# EAGLE design stm32f3-shield (EAGLE 7.4.0)
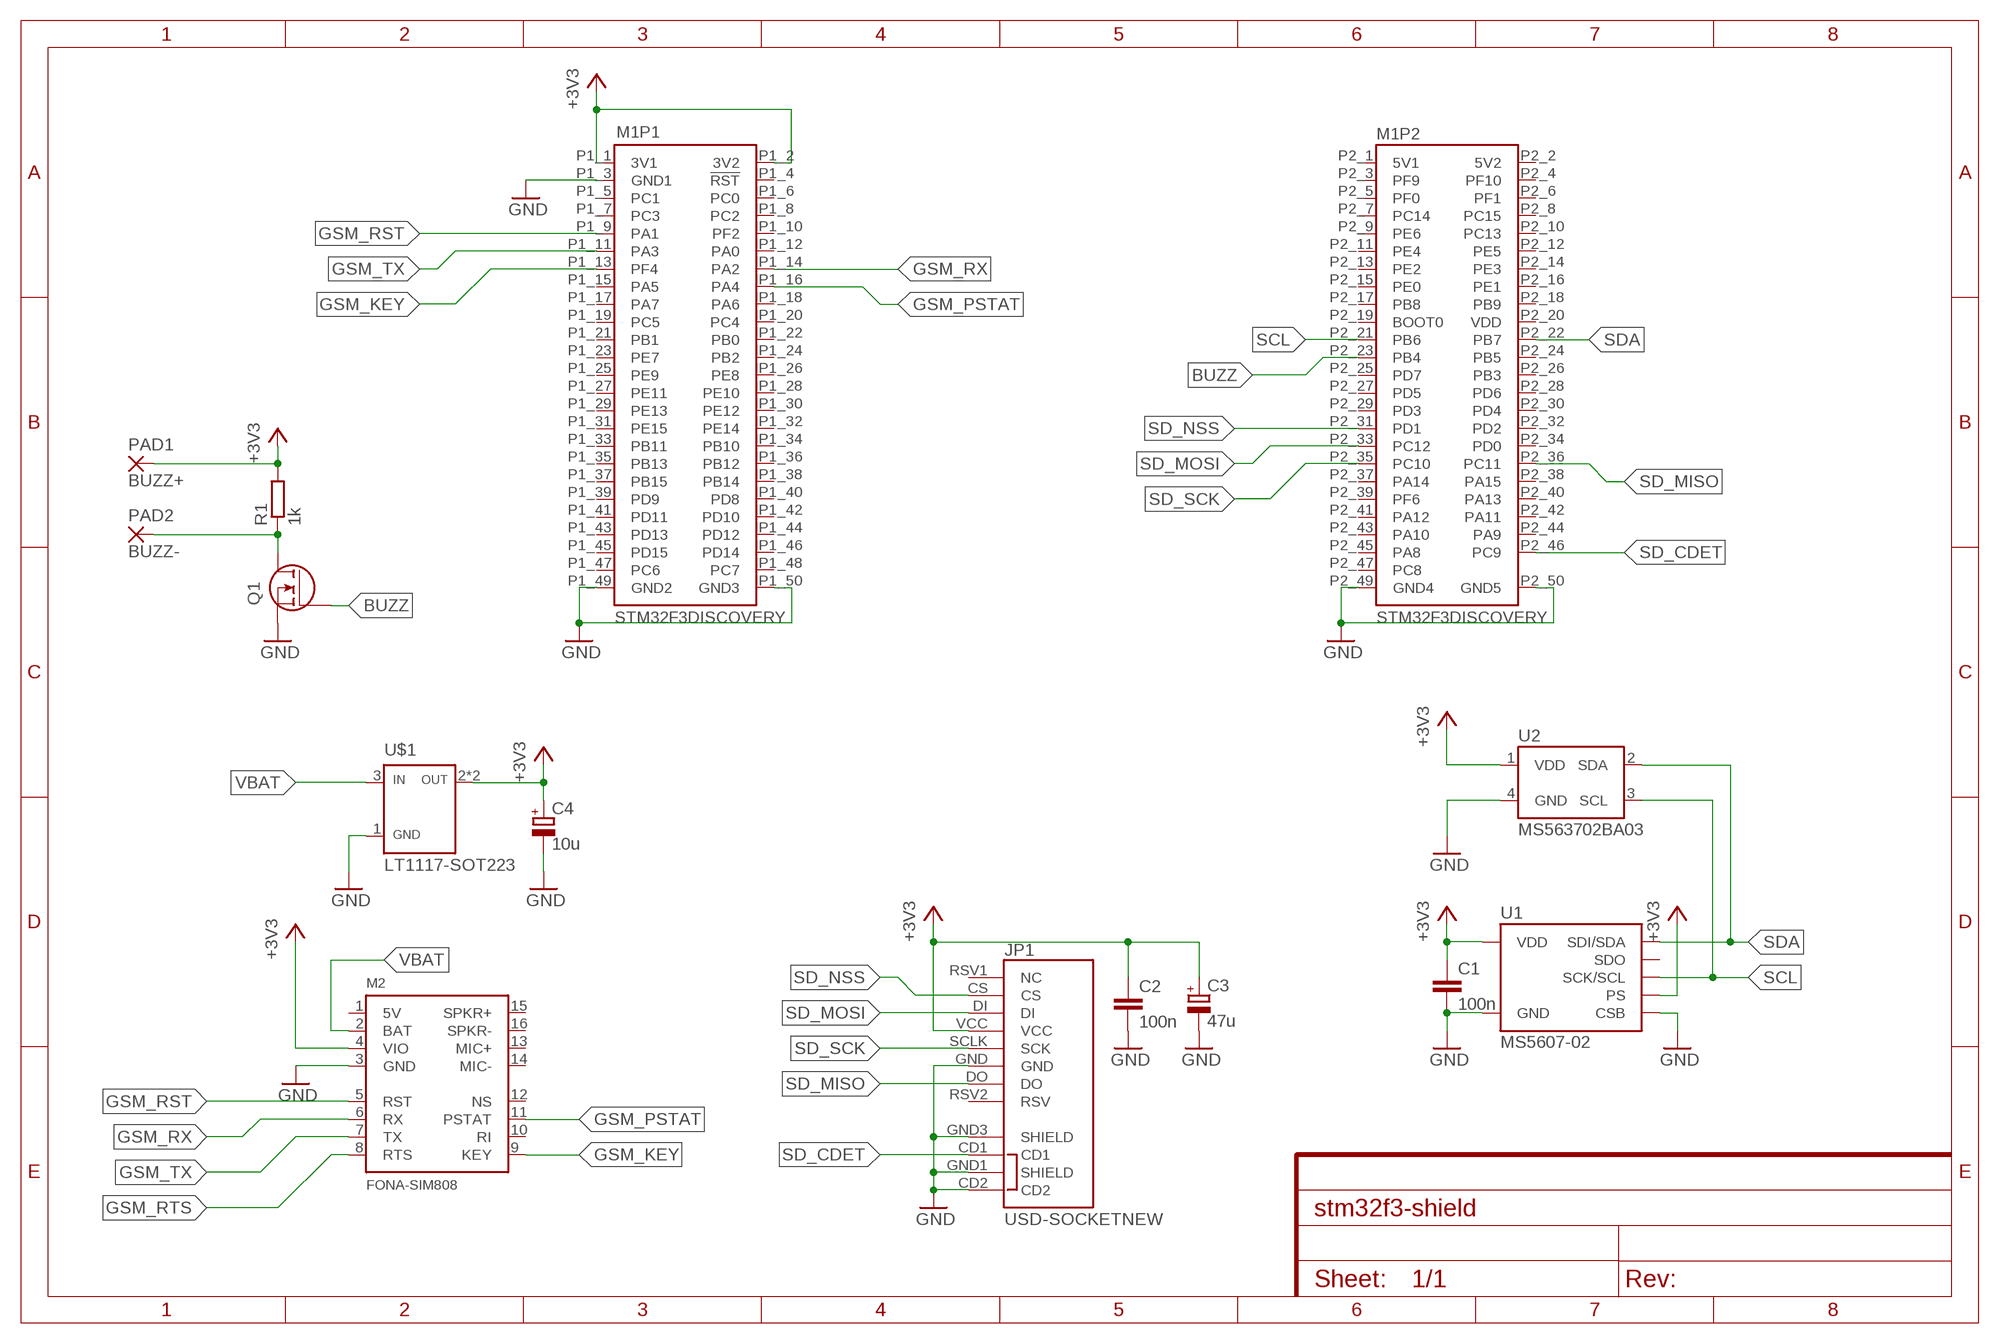
[diagram p0: schematic, sheet 1]

## Parts
C1  100n  C-EUC0805K  [C0805K]
C2  100n  C-EUC0805K  [C0805K]
C3  47u  CPOL-EUSMCB  [SMC_B]
C4  10u  CPOL-EUSMCB  [SMC_B]
JP1  USD-SOCKETNEW  [MICRO-SD-SOCKET-PP]
M1  STM32F3DISCOVERY  [STM32F3DISCOVERY]
M2  FONA-SIM808  [FONA-SIM808]
PAD1  BUZZ+  2,54/0,8  [2,54/0,8]
PAD2  BUZZ-  2,54/0,8  [2,54/0,8]
Q1  MOSFET-N-SOT23-3  [SOT23-3]
R1  1k  R-EU_R0603  [R0603]
U1  MS5607-02  [LGA8]
U2  MS563702BA03  [MS5637]
U$1  LT1117-SOT223  [SOT223]

## Nets
+3V3: C1.1 C2.1 C3.+ C4.+ JP1.VCC M1.P1_1(P1:3V1) M1.P1_2(P1:3V2) M2.4(VIO) PAD1.1(P) R1.2 U1.1(VDD) U1.2(PS) U2.1(VDD) U$1.2(OUT) U$1.4(OUT)
BUZZ: M1.P2_23(P2:PB4) Q1.1(G)
GND: C1.2 C2.2 C3.- C4.- JP1.CD2 JP1.GND JP1.GND1(SHIELD) JP1.GND3(SHIELD) M1.P1_3(P1:GND1) M1.P1_49(P1:GND2) M1.P1_50(P1:GND3) M1.P2_49(P2:GND4) M1.P2_50(P2:GND5) M2.3(GND) Q1.2(S) U1.3(GND) U1.4(CSB) U1.5(CSB) U2.4(GND) U$1.1(GND)
GSM_KEY: M1.P1_13(P1:PF4) M2.9(KEY)
GSM_PSTAT: M1.P1_16(P1:PA4) M2.11(PSTAT)
GSM_RST: M1.P1_9(P1:PA1) M2.5(RST)
GSM_RTS: M2.8(RTS)
GSM_RX: M1.P1_14(P1:PA2) M2.6(RX)
GSM_TX: M1.P1_11(P1:PA3) M2.7(TX)
N$1: PAD2.1(P) Q1.3(D) R1.1
SCL: M1.P2_21(P2:PB6) U1.8(SCK/SCL) U2.3(SCL)
SD_CDET: JP1.CD1 M1.P2_46(P2:PC9)
SD_MISO: JP1.DO M1.P2_36(P2:PC11)
SD_MOSI: JP1.DI M1.P2_33(P2:PC12)
SD_NSS: JP1.CS M1.P2_31(P2:PD1)
SD_SCK: JP1.SCLK(SCK) M1.P2_35(P2:PC10)
SDA: M1.P2_22(P2:PB7) U1.7(SDI/SDA) U2.2(SDA)
VBAT: M2.2(BAT) U$1.3(IN)
Unconnected: JP1.RSV1(NC) JP1.RSV2(RSV) M1.P1_4(P1:!RST) M1.P1_5(P1:PC1) M1.P1_6(P1:PC0) M1.P1_7(P1:PC3) M1.P1_8(P1:PC2) M1.P1_10(P1:PF2) M1.P1_12(P1:PA0) M1.P1_15(P1:PA5) M1.P1_17(P1:PA7) M1.P1_18(P1:PA6) M1.P1_19(P1:PC5) M1.P1_20(P1:PC4) M1.P1_21(P1:PB1) M1.P1_22(P1:PB0) M1.P1_23(P1:PE7) M1.P1_24(P1:PB2) M1.P1_25(P1:PE9) M1.P1_26(P1:PE8) M1.P1_27(P1:PE11) M1.P1_28(P1:PE10) M1.P1_29(P1:PE13) M1.P1_30(P1:PE12) M1.P1_31(P1:PE15) M1.P1_32(P1:PE14) M1.P1_33(P1:PB11) M1.P1_34(P1:PB10) M1.P1_35(P1:PB13) M1.P1_36(P1:PB12) M1.P1_37(P1:PB15) M1.P1_38(P1:PB14) M1.P1_39(P1:PD9) M1.P1_40(P1:PD8) M1.P1_41(P1:PD11) M1.P1_42(P1:PD10) M1.P1_43(P1:PD13) M1.P1_44(P1:PD12) M1.P1_45(P1:PD15) M1.P1_46(P1:PD14) M1.P1_47(P1:PC6) M1.P1_48(P1:PC7) M1.P2_1(P2:5V1) M1.P2_2(P2:5V2) M1.P2_3(P2:PF9) M1.P2_4(P2:PF10) M1.P2_5(P2:PF0) M1.P2_6(P2:PF1) M1.P2_7(P2:PC14) M1.P2_8(P2:PC15) M1.P2_9(P2:PE6) M1.P2_10(P2:PC13) M1.P2_11(P2:PE4) M1.P2_12(P2:PE5) M1.P2_13(P2:PE2) M1.P2_14(P2:PE3) M1.P2_15(P2:PE0) M1.P2_16(P2:PE1) M1.P2_17(P2:PB8) M1.P2_18(P2:PB9) M1.P2_19(P2:BOOT0) M1.P2_20(P2:VDD) M1.P2_24(P2:PB5) M1.P2_25(P2:PD7) M1.P2_26(P2:PB3) M1.P2_27(P2:PD5) M1.P2_28(P2:PD6) M1.P2_29(P2:PD3) M1.P2_30(P2:PD4) M1.P2_32(P2:PD2) M1.P2_34(P2:PD0) M1.P2_37(P2:PA14) M1.P2_38(P2:PA15) M1.P2_39(P2:PF6) M1.P2_40(P2:PA13) M1.P2_41(P2:PA12) M1.P2_42(P2:PA11) M1.P2_43(P2:PA10) M1.P2_44(P2:PA9) M1.P2_45(P2:PA8) M1.P2_47(P2:PC8) M2.1(5V) M2.10(RI) M2.12(NS) M2.13(MIC+) M2.14(MIC-) M2.15(SPKR+) M2.16(SPKR-) U1.6(SDO)

## Library data of the parts
C1 C2 = rcl:C-EU: CAPACITOR, European symbol
C3 C4 = rcl:CPOL-EU: POLARIZED CAPACITOR, European symbol
JP1 = SparkFun-Connectors:USD-SOCKET: microSD Socket Push-push type uSD socket. Schematic element and footprint production proven. Spark Fun Electronics SKU : PRT-00127. tDoc lines correctly indicate media card edge positions when inserting (unlocked, locked, depressed). NOTE: CD1 and CD2 are connected internally; PROD_ID: CONN-07820
M1 = kg-modules:STM32F3DISCOVERY
M2 = kg-modules:FONA-SIM808: FONA GPS board with SIM808 module
PAD1 PAD2 = wirepad:2,54/0,8: THROUGH-HOLE PAD
Q1 = kg-generic:MOSFET-N: Generic N-MOSFET MFG P/N Package Description IRF7406 SO8 30V/5.8A SI7820DN TRANS-11055 FDS6630A IC-08089 2N7002PW TRANS-11151 FQP30N06L COM-10213 TRANS-10060 BSS123LT1G TRANS-08345 BSS138 TRANS-00830 BS170 2N7000
R1 = rcl:R-EU_: RESISTOR, European symbol
U1 = kg-ic:MS5607-02: MS5607-02BA03 Barometric Pressure Sensor, with stainless steel cap
U2 = kg-ic:MS5637: MS5637-02BA03 Low Voltage Barometric Pressure Sensor The MS5637 is an ultra-compact micro altimeter. It is optimized for altimeter and barometer applications in Smart-phones and Tablet PCs. The altitude resolution at sea level is 13 cm of air.
U$1 = kg-supply:LT1117

## Board
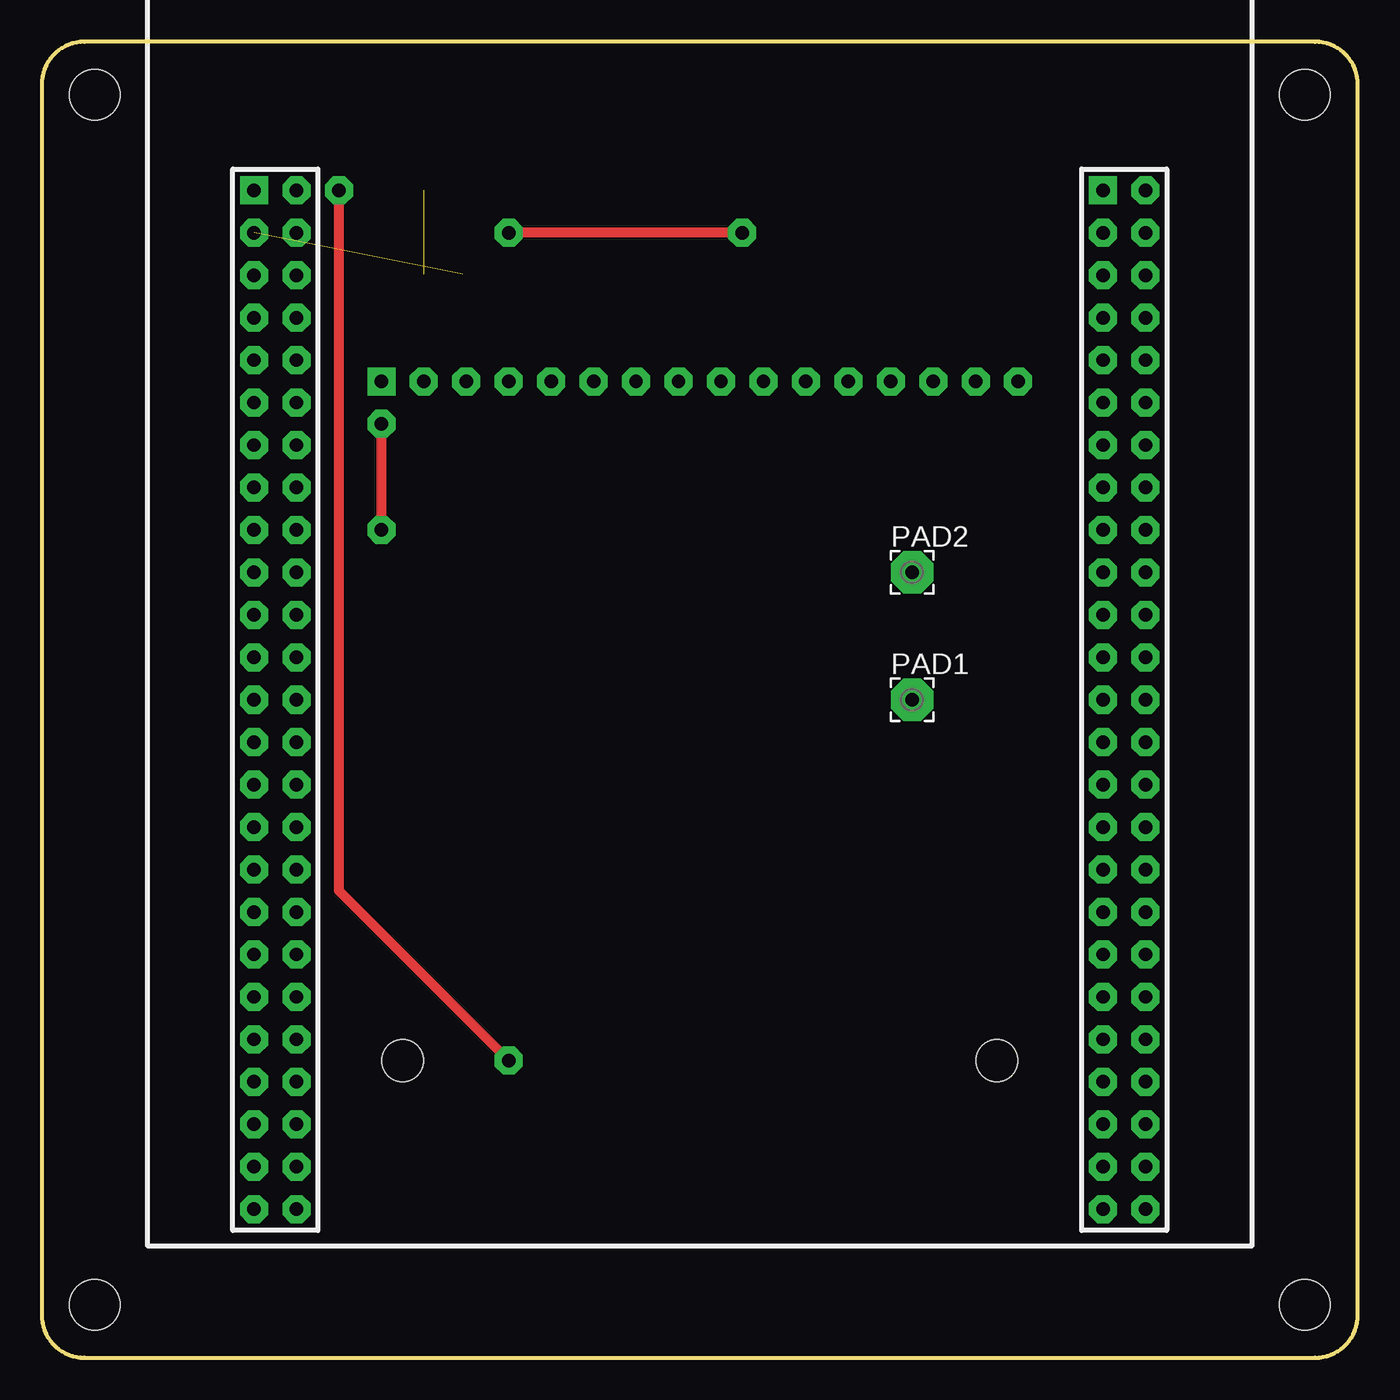
[diagram p1: board, top side]
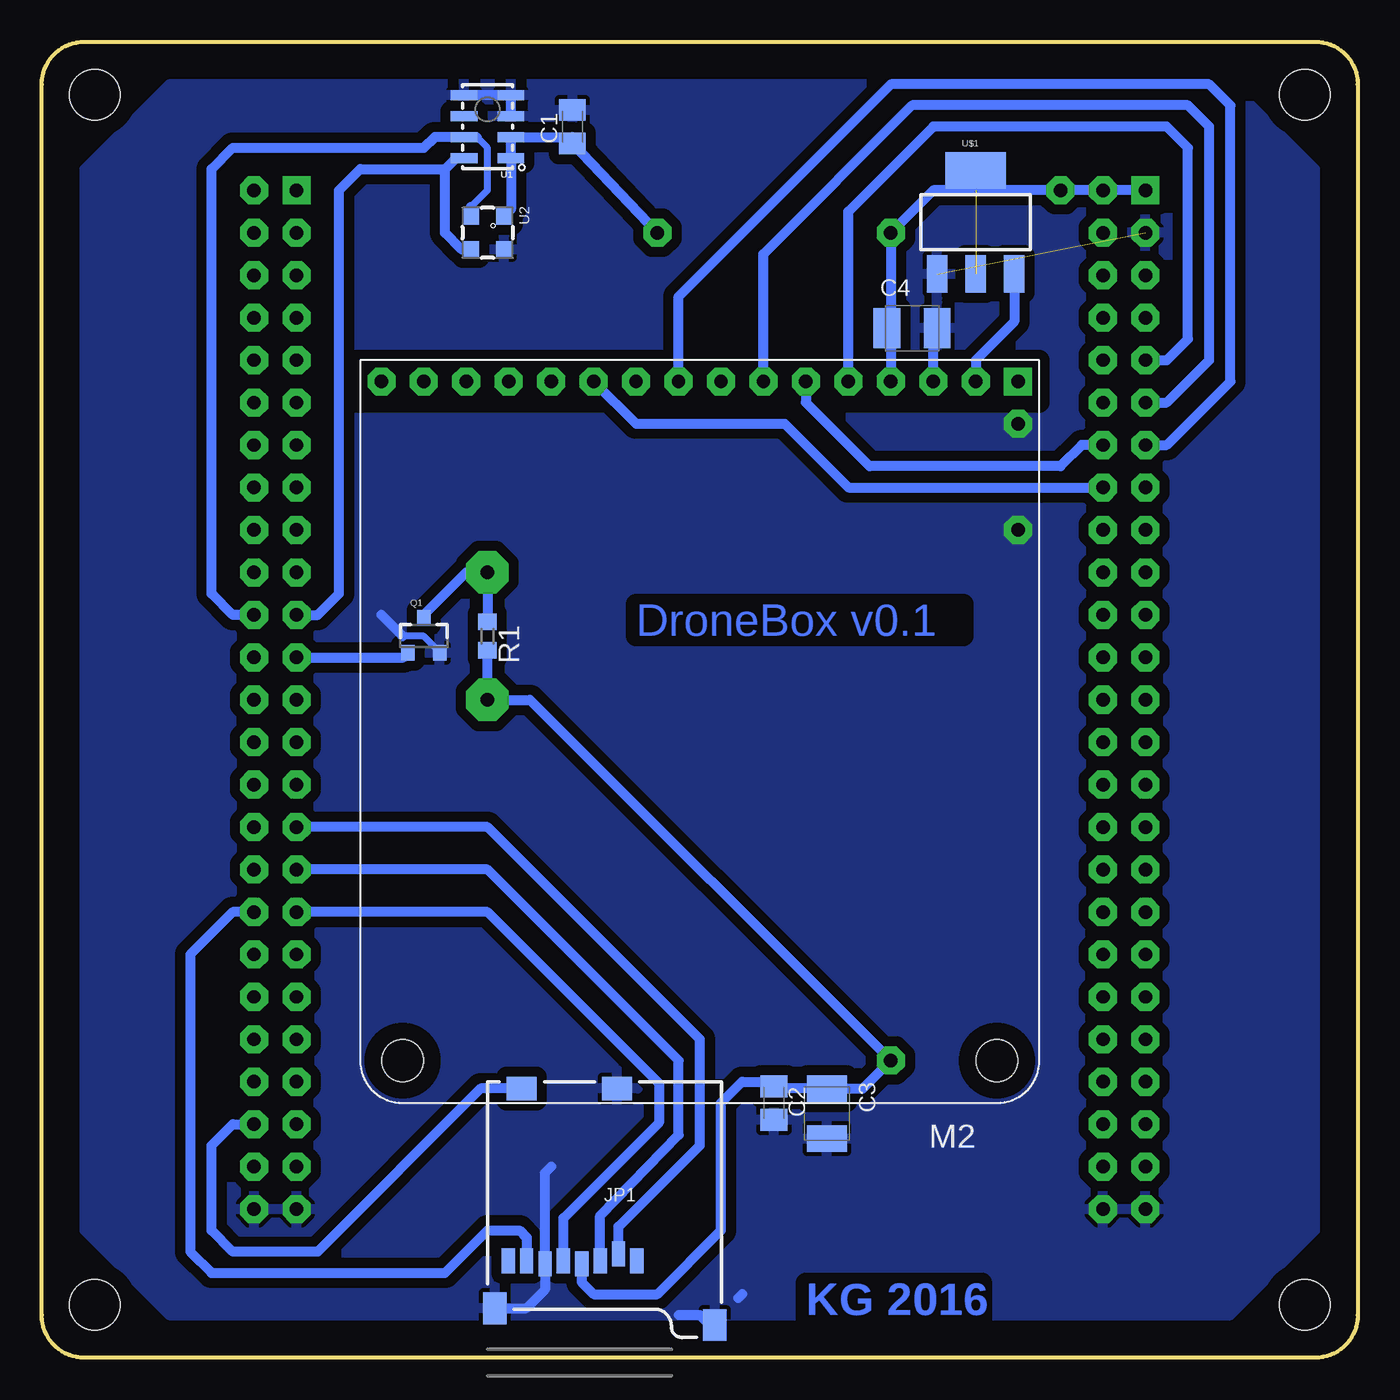
[diagram p2: board, bottom side, seen from below]

Size 78.74 x 78.74 mm. Coordinates in mm from the lower left corner, seen from the top.
Outline: 0,76.2 0,2.54 arc90 2.54,0 76.2,0 arc90 78.74,2.54 78.74,76.2 arc90 76.2,78.74 2.54,78.74 arc90 0,76.2
Copper layers (1*16): Top 0.035mm / dielectric 1.5mm / Bottom 0.035mm
Design rules "default": minimum track width 10mil, minimum drill 24mil, track to track 8mil, track to pad 8mil, pad to pad 8mil, via to via 8mil, smd to smd 8mil, copper to edge 40mil, drill to drill 8mil, minimum pad ring 10mil, minimum via ring 8mil, stop-mask expansion 4mil, vias tented up to drill 0mil, thermal gap 10mil
Holes 3 mm at 3.17,3.18 75.56,3.18 3.17,75.56 75.56,75.56
bRestrict: area 19.1,57.1 to 59.7,59.7

### Footprints (pad centres in the part's own frame; a part is rotated, then mirrored left to right if it is on the bottom)
C0805K = smd 1.3 x 1.6: 1 -1,0; 2 1,0
SMC_B = smd 1.6 x 2.4: + -1.5,0; - 1.5,0
MICRO-SD-SOCKET-PP = smd 1.8 x 1.4: CD1 -2.05,0.4; CD2 -7.75,0.4 | smd 0.8 x 1.5: CS -7.84,10.3; DI -6.74,10.7; DO -2.34,10.7; GND -3.44,10.9; RSV1 -8.94,10.7; RSV2 -1.24,10.7; SCLK -4.54,10.7; VCC -5.64,10.9 | smd 1.4 x 1.9: GND1 -13.6,14.55; GND3 -0.45,13.55
STM32F3DISCOVERY = drill 0.8 pad 1.676 square: P1_1 0,60.96; P2_1 50.8,60.96 | drill 0.8 pad 1.676 octagon: P1_2 2.54,60.96; P1_3 0,58.42; P1_4 2.54,58.42; P1_5 0,55.88; P1_6 2.54,55.88; P1_7 0,53.34; P1_8 2.54,53.34; P1_9 0,50.8; P1_10 2.54,50.8; P1_11 0,48.26; P1_12 2.54,48.26; P1_13 0,45.72; P1_14 2.54,45.72; P1_15 0,43.18; P1_16 2.54,43.18; P1_17 0,40.64; P1_18 2.54,40.64; P1_19 0,38.1; P1_20 2.54,38.1; P1_21 0,35.56; P1_22 2.54,35.56; P1_23 0,33.02; P1_24 2.54,33.02; P1_25 0,30.48; P1_26 2.54,30.48; P1_27 0,27.94; P1_28 2.54,27.94; P1_29 0,25.4; P1_30 2.54,25.4; P1_31 0,22.86; P1_32 2.54,22.86; P1_33 0,20.32; P1_34 2.54,20.32; P1_35 0,17.78; P1_36 2.54,17.78; P1_37 0,15.24; P1_38 2.54,15.24; P1_39 0,12.7; P1_40 2.54,12.7; P1_41 0,10.16; P1_42 2.54,10.16; P1_43 0,7.62; P1_44 2.54,7.62; P1_45 0,5.08; P1_46 2.54,5.08; P1_47 0,2.54; P1_48 2.54,2.54; P1_49 0,0; P1_50 2.54,0; P2_2 53.34,60.96; P2_3 50.8,58.42; P2_4 53.34,58.42; P2_5 50.8,55.88; P2_6 53.34,55.88; P2_7 50.8,53.34; P2_8 53.34,53.34; P2_9 50.8,50.8; P2_10 53.34,50.8; P2_11 50.8,48.26; P2_12 53.34,48.26; P2_13 50.8,45.72; P2_14 53.34,45.72; P2_15 50.8,43.18; P2_16 53.34,43.18; P2_17 50.8,40.64; P2_18 53.34,40.64; P2_19 50.8,38.1; P2_20 53.34,38.1; P2_21 50.8,35.56; P2_22 53.34,35.56; P2_23 50.8,33.02; P2_24 53.34,33.02; P2_25 50.8,30.48; P2_26 53.34,30.48; P2_27 50.8,27.94; P2_28 53.34,27.94; P2_29 50.8,25.4; P2_30 53.34,25.4; P2_31 50.8,22.86; P2_32 53.34,22.86; P2_33 50.8,20.32; P2_34 53.34,20.32; P2_35 50.8,17.78; P2_36 53.34,17.78; P2_37 50.8,15.24; P2_38 53.34,15.24; P2_39 50.8,12.7; P2_40 53.34,12.7; P2_41 50.8,10.16; P2_42 53.34,10.16; P2_43 50.8,7.62; P2_44 53.34,7.62; P2_45 50.8,5.08; P2_46 53.34,5.08; P2_47 50.8,2.54; P2_48 53.34,2.54; P2_49 50.8,0; P2_50 53.34,0
FONA-SIM808 = drill 0.8 pad 1.676 square: 1 0,0 | drill 0.8 pad 1.676 octagon: 2 2.54,0; 3 5.08,0; 4 7.62,0; 5 10.16,0; 6 12.7,0; 7 15.24,0; 8 17.78,0; 9 20.32,0; 10 22.86,0; 11 25.4,0; 12 27.94,0; 13 30.48,0; 14 33.02,0; 15 35.56,0; 16 38.1,0 | hole 2.5: 1.27,40.64; 36.83,40.64
2,54/0,8 = drill 0.813 pad 2.54 octagon: 1 0,0
SOT23-3 = smd 0.8 x 0.9: 1 -0.95,-1; 2 0.95,-1; 3 0,1.1
R0603 = smd 1 x 1.1: 1 -0.85,0; 2 0.85,0
LGA8 = smd 1.6 x 0.6: 1 -1.4,1.875; 2 -1.4,0.625; 3 -1.4,-0.625; 4 -1.4,-1.875; 5 1.4,-1.875; 6 1.4,-0.625; 7 1.4,0.625; 8 1.4,1.875
MS5637 = smd 1 x 1: 1 -1,1; 2 -1,-1; 3 1,-1; 4 1,1
SOT223 = smd 1.219 x 2.235: 1 -2.311,-3.099; 2 0,-3.099; 3 2.311,-3.099 | smd 3.6 x 2.2: 4 0,3.099

### Placement (x,y rotation side)
C1  46.99,73.66 90 bottom
C2  34.93,15.24 270 bottom
C3  31.75,14.61 270 bottom
C4  26.67,61.59 0 bottom
JP1  52.07,16.51 180 bottom
M1  12.7,8.89 0 top
M2  20.32,58.42 180 bottom
PAD1  52.07,39.37 0 top
PAD2  52.07,46.99 0 top
Q1  55.88,43.18 0 bottom
R1  52.07,43.18 270 bottom
U1  52.07,73.66 180 bottom
U2  52.07,67.31 270 bottom
U$1  22.86,67.94 0 bottom

### Tracks (layer width: path | path; a pad name or v marks a point on that pad's centre or on a via)
+3V3  (via drill 0.8 pad 1.68)  (1 unrouted)
  Top 0.61: v27.94,17.78 17.78,27.94 v17.78,69.85 | v41.91,67.31 v27.94,67.31
  Bottom 0.61: M1.P1_1 M1.P1_2 v17.78,69.85 22.86,69.85 | 22.86,69.85 25.4,69.85 v27.94,67.31 27.94,60.96 | 27.94,60.96 M2.4 | v41.91,67.31 C1.1 46.99,73.03 U1.2 U1.1 50.67,68.71 U2.1 | U$1.4 22.86,69.85 | C4.+ 28.17,61.19 27.94,60.96 | R1.2 PAD1.1 49.53,39.37 v27.94,17.78 29.61,16.11 C3.+ 34.79,16.11 C2.1 35.2,16.51 36.83,16.51 38.1,15.24 38.1,7.62 41.91,3.81 45.72,3.81 46.43,4.52 JP1.VCC
BUZZ
  Bottom 0.61: M1.P2_23 57.1,41.91 Q1.1
GND  (via drill 0.8 pad 1.68)  (1 unrouted)
  Top 0.61: v20.32,49.53 v20.32,55.88
  Bottom 0.406: 54.93,42.23 55.88,43.18 57.15,43.18
  Bottom 0.61: U1.3 U1.4 U1.5 | 37.08,3.57 36.83,3.81 | M2.3 25.4,61.36 C4.- | Q1.2 54.93,42.23 | 57.15,43.18 58.42,44.45 | JP1.GND1 38.79,1.96 39.37,2.54 40.64,2.54 | 48.26,11.43 48.63,11.06 JP1.GND 48.63,4.07 49.75,2.96 JP1.GND3
  pour Bottom (isolate 0.61): 2.54,71.12 7.62,76.2 71.12,76.2 76.2,71.12 76.2,7.62 71.12,2.54 7.62,2.54 2.54,7.62
GSM_KEY
  Bottom 0.61: M1.P1_13 11.43,54.61 7.62,58.42 7.62,74.93 8.89,76.2 27.94,76.2 40.64,63.5 M2.9
GSM_PSTAT
  Bottom 0.61: M1.P1_16 30.48,52.07 34.29,55.88 43.18,55.88 M2.11
GSM_RST
  Bottom 0.61: M1.P1_9 11.43,59.69 10.16,60.96 10.16,72.39 11.43,73.66 25.4,73.66 30.48,68.58 M2.5
GSM_RX
  Bottom 0.61: M1.P1_14 16.51,54.61 17.78,53.34 29.21,53.34 33.02,57.15 M2.6
GSM_TX
  Bottom 0.61: M1.P1_11 11.43,57.15 8.89,59.69 8.89,73.66 10.16,74.93 26.67,74.93 35.56,66.04 M2.7
N$1
  Bottom 0.61: R1.1 PAD2.1 53.34,46.99 55.88,44.45 Q1.3
SCL
  Bottom 0.61: M1.P2_21 62.23,44.45 60.96,45.72 60.96,69.85 59.69,71.12 54.61,71.12 | U1.8 53.95,71.78 54.61,71.12 | U2.3 53.61,66.31 54.61,67.31 54.61,71.12
SD_CDET
  Bottom 0.61: JP1.CD1 52.47,16.11 62.23,6.35 67.31,6.35 68.58,7.62 68.58,12.7 67.31,13.97 M1.P2_46
SD_MISO
  Bottom 0.61: M1.P2_36 67.31,26.67 69.85,24.13 69.85,6.35 68.58,5.08 54.61,5.08 52.07,7.62 50.16,7.62 49.73,7.19 JP1.DO
SD_MOSI
  Bottom 0.61: JP1.DI 45.33,8.5 40.64,13.34 40.64,17.78 52.07,29.21 M1.P2_33
SD_NSS
  Bottom 0.61: JP1.CS 44.23,7.84 39.37,12.7 39.37,19.05 52.07,31.75 M1.P2_31
SD_SCK
  Bottom 0.61: M1.P2_35 52.07,26.67 41.82,16.41 41.82,14.07 47.53,8.35 JP1.SCLK
SDA
  Bottom 0.406: 53.07,68.85 52.07,69.85 52.07,72.39 52.71,73.02
  Bottom 0.61: M1.P2_22 67.31,44.45 68.58,45.72 68.58,71.12 67.31,72.39 55.88,72.39 55.23,73.03 U1.7 52.71,73.02 | U2.2 53.07,68.85
VBAT
  Bottom 0.61: U$1.3 20.55,62 22.86,59.69 M2.2
(copper drawn outside any net)
  shapes: Bottom circle x4

### Text on the board
Bottom: DroneBox v0.1 | KG 2016